# Altium project Linobyte - word.PrjPCB
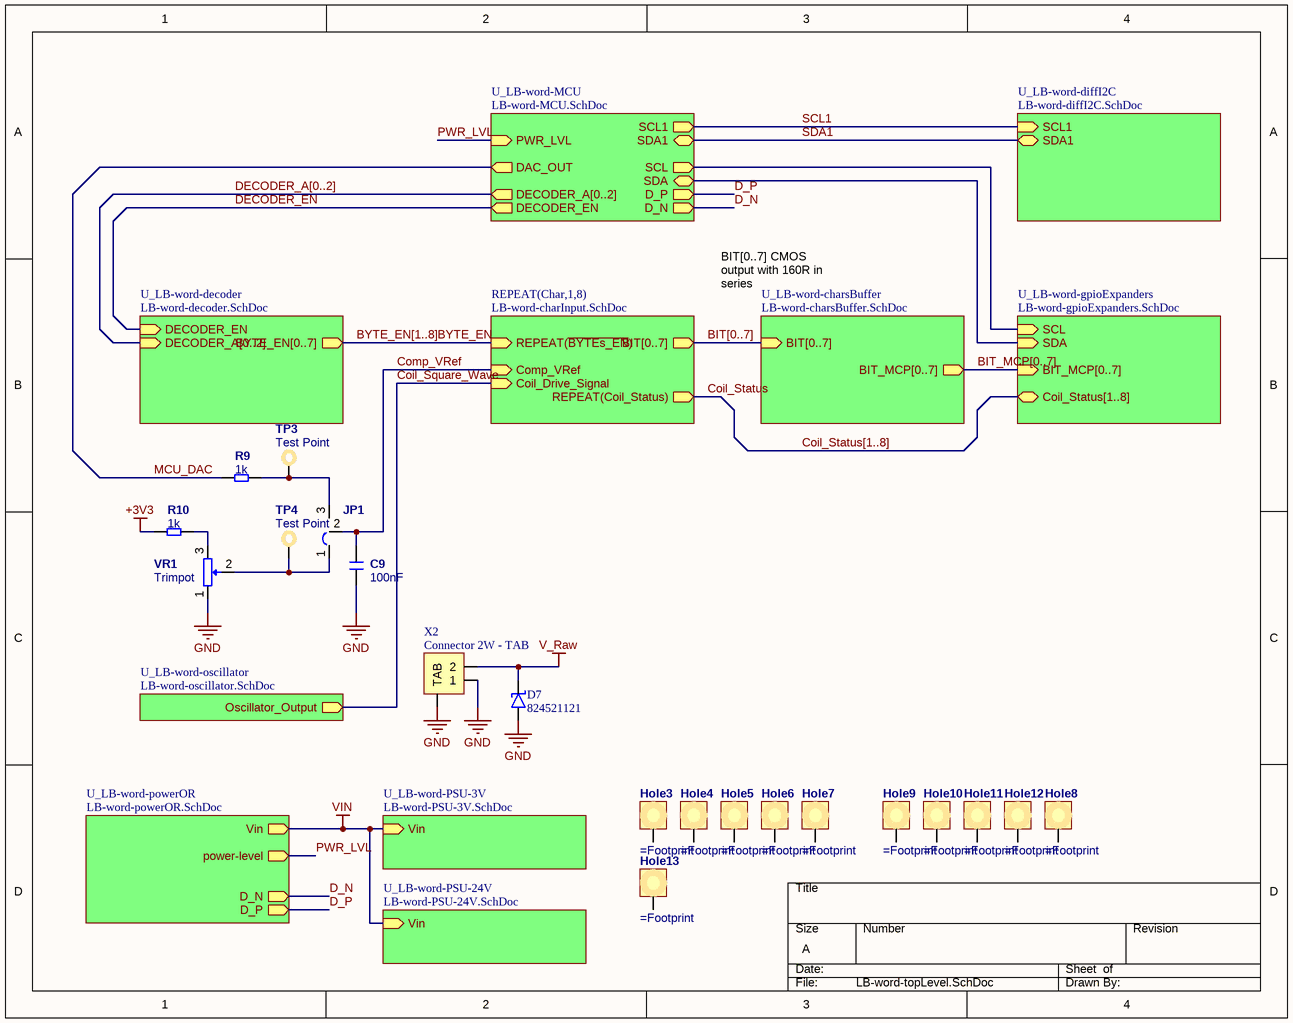
[diagram p0: LB-word-topLevel.SchDoc]
11 sheets, 411 parts. Net scope: hierarchical (ports join the sheet entries above them; power ports are global).
Board file: LB-word-PCB.PcbDoc
Sheets:
  LB-word-topLevel.SchDoc
    Char1 = LB-word-charInput.SchDoc
    Char2 = LB-word-charInput.SchDoc
    Char3 = LB-word-charInput.SchDoc
    Char4 = LB-word-charInput.SchDoc
    Char5 = LB-word-charInput.SchDoc
    Char6 = LB-word-charInput.SchDoc
    Char7 = LB-word-charInput.SchDoc
    Char8 = LB-word-charInput.SchDoc
    U_LB-word-decoder = LB-word-decoder.SchDoc
    U_LB-word-charsBuffer = LB-word-charsBuffer.SchDoc
    U_LB-word-PSU-3V = LB-word-PSU-3V.SchDoc
    U_LB-word-powerOR = LB-word-powerOR.SchDoc
    U_LB-word-PSU-24V = LB-word-PSU-24V.SchDoc
    U_LB-word-gpioExpanders = LB-word-gpioExpanders.SchDoc
    U_LB-word-oscillator = LB-word-oscillator.SchDoc
    U_LB-word-MCU = LB-word-MCU.SchDoc
    U_LB-word-diffI2C = LB-word-diffI2C.SchDoc

## Sheet LB-word-topLevel.SchDoc
size A

### Parts
C9  100nF  [C0603_N]
D7  824521121  [DO214AC SMA]
Hole3  (no value)  [M3 Plated Hole]
Hole4  (no value)  [M3 Plated Hole]
Hole5  (no value)  [M3 Plated Hole]
Hole6  (no value)  [M3 Plated Hole]
Hole7  (no value)  [M3 Plated Hole]
Hole8  (no value)  [M3 Plated Hole]
Hole9  (no value)  [M3 Plated Hole]
Hole10  (no value)  [M3 Plated Hole]
Hole11  (no value)  [M3 Plated Hole]
Hole12  (no value)  [M3 Plated Hole]
Hole13  (no value)  [M3 Plated Hole]
JP1  Jumper 3W  [Jumper SMD 3W NO]  (value not drawn)
R9  1k  [R0603]
R10  1k  [R0603]
TP3  Test Point  [TestPoint-1.2mm]
TP4  Test Point  [TestPoint-1.2mm]
VR1  Trimpot  [Trimpot 3314]
X2  Connector 2W - TAB  [PTSM-2W-H-SMD]

### Sub-sheets
REPEAT(Char,1,8) = LB-word-charInput.SchDoc: BIT[0..7] (out), Comp_VRef (in), REPEAT(~{BYTEs_EN}) (in), REPEAT(Coil_Status) (out), Coil_Drive_Signal (in)
U_LB-word-charsBuffer = LB-word-charsBuffer.SchDoc: BIT[0..7] (in), BIT_MCP[0..7] (out)
U_LB-word-decoder = LB-word-decoder.SchDoc: BYTE_EN[0..7] (out), DECODER_A[0..2] (in), DECODER_EN (in)
U_LB-word-diffI2C = LB-word-diffI2C.SchDoc: SDA1 (bidir), SCL1 (in)
U_LB-word-gpioExpanders = LB-word-gpioExpanders.SchDoc: SCL (in), SDA (in), BIT_MCP[0..7] (in), Coil_Status[1..8] (bidir)
U_LB-word-MCU = LB-word-MCU.SchDoc: SDA (bidir), SCL (out), DAC_OUT (out), DECODER_A[0..2] (out), DECODER_EN (out), D_P (out), D_N (out), SCL1 (out), SDA1 (bidir), PWR_LVL (in)
U_LB-word-oscillator = LB-word-oscillator.SchDoc: Oscillator_Output (out)
U_LB-word-powerOR = LB-word-powerOR.SchDoc: Vin (out), power-level (out), D_N (out), D_P (out)
U_LB-word-PSU-3V = LB-word-PSU-3V.SchDoc: Vin (in)
U_LB-word-PSU-24V = LB-word-PSU-24V.SchDoc: Vin (in)

### Nets
+3V3: R10.1
GND: C9.2 D7.A VR1.1 X2.1 X2.TAB
V_Raw: D7.K X2.2
VIN: sheet U_LB-word-PSU-3V/Vin, sheet U_LB-word-powerOR/Vin, sheet U_LB-word-PSU-24V/Vin
BYTE_EN: sheet REPEAT(Char,1,8)/REPEAT(~{BYTEs_EN})
Coil_Square_Wave: sheet REPEAT(Char,1,8)/Coil_Drive_Signal, sheet U_LB-word-oscillator/Oscillator_Output
Coil_Status: sheet REPEAT(Char,1,8)/REPEAT(Coil_Status)
Comp_VRef: C9.1 JP1.2 ; sheet REPEAT(Char,1,8)/Comp_VRef
D_N: sheet U_LB-word-powerOR/D_N, sheet U_LB-word-MCU/D_N
D_P: sheet U_LB-word-powerOR/D_P, sheet U_LB-word-MCU/D_P
DECODER_EN: sheet U_LB-word-decoder/DECODER_EN, sheet U_LB-word-MCU/DECODER_EN
MCU_DAC: R9.1 ; sheet U_LB-word-MCU/DAC_OUT
PWR_LVL: sheet U_LB-word-powerOR/power-level, sheet U_LB-word-MCU/PWR_LVL  [project net A5]
SCL: sheet U_LB-word-gpioExpanders/SCL, sheet U_LB-word-MCU/SCL
SCL1: sheet U_LB-word-MCU/SCL1, sheet U_LB-word-diffI2C/SCL1
SDA: sheet U_LB-word-gpioExpanders/SDA, sheet U_LB-word-MCU/SDA
SDA1: sheet U_LB-word-MCU/SDA1, sheet U_LB-word-diffI2C/SDA1
NetJP1_1: JP1.1 TP4.1 VR1.2
NetJP1_3: JP1.3 R9.2 TP3.1
NetR10_2: R10.2 VR1.3

Not connected (* = marked no-connect by the designer): Hole3 1; Hole4 1; Hole5 1; Hole6 1; Hole7 1; Hole8 1; Hole9 1; Hole10 1; Hole11 1; Hole12 1; Hole13 1

### Buses and harness runs
bus BIT[0..7] = sheet REPEAT(Char,1,8)/BIT[0..7] = sheet U_LB-word-charsBuffer/BIT[0..7]
bus BIT_MCP[0..7] = sheet U_LB-word-charsBuffer/BIT_MCP[0..7] = sheet U_LB-word-gpioExpanders/BIT_MCP[0..7]
bus BYTE_EN[1..8] = sheet U_LB-word-decoder/BYTE_EN[0..7]
bus Coil_Status[1..8] = sheet U_LB-word-gpioExpanders/Coil_Status[1..8]
bus DECODER_A[0..2] = sheet U_LB-word-decoder/DECODER_A[0..2] = sheet U_LB-word-MCU/DECODER_A[0..2]

### Notes on the sheet
- BIT[0..7] CMOS output with 160R in series

### Library data of the parts
C9 = Capacitor: Capacitor MLCC; Manufacturer: Yageo; Manufacturer Part Number: CC0603KRX7R9BB104; Tolerance (%): 10; Category: Capacitor; Package: 0603; Value: 100nF; Supplier Part Number 1: 1362556; Supplier 1: Farnell; ComponentLink1URL: http://www.yageo.com; ComponentLink1Description: Manufacturer Website; Voltage Rating (Volts): *; Supplier 2: Digi-Key; Supplier Part Number 2: 311-1344-1-ND
D7 = TVS
Hole3-Hole13 = Hole: Footprint: =Footprint
R9 R10 = Resistor: Published: 17-Dec-2003; LatestRevisionDate: 19-Mar-2004; LatestRevisionNote: Silkscreen size reduced.; PackageDocument: Mar-2003; PackageReference: 3-0603; Publisher: Altium Limited; Code_IPC: 1608 [0603]; ComponentLink1Description: Manufacturer Link; ComponentLink1URL: http://www.panasonic.com/industrial/components/resistive_products.htm; ComponentLink2Description: Datasheet; ComponentLink2URL: http://www.panasonic.com/industrial/components/pdf/AOA0000CE2.pdf; Value: 1k

## Sheet LB-word-charInput.SchDoc
size A4
Used 8 times, as channels Char1, Char2, Char3, Char4, Char5, Char6, Char7, Char8. Parts and nets are listed once, with the designators drawn on the sheet.
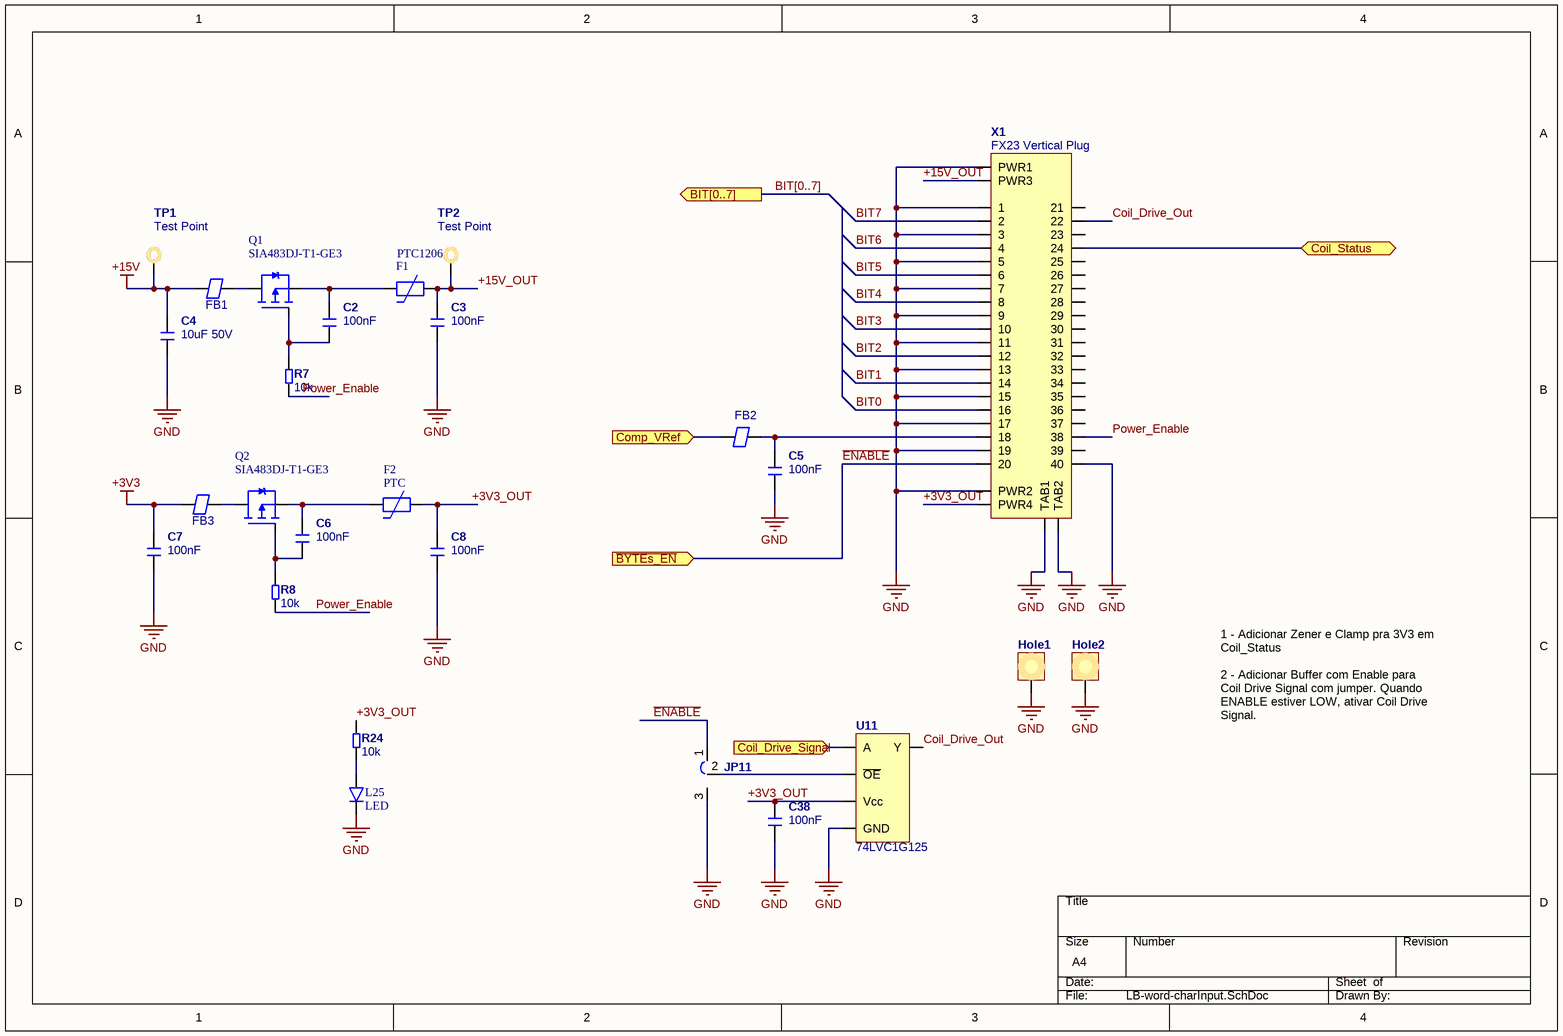
[diagram p1: LB-word-charInput.SchDoc]

### Parts
C2  100nF  [C0603_N]
C3  100nF  [C0603_N]
C4  10uF 50V  [C1210_N]
C5  100nF  [C0603_N]
C6  100nF  [C0603_N]
C7  100nF  [C0603_N]
C8  100nF  [C0603_N]
C38  100nF  [C0603_N]
F1  PTC1206  [C1206_N]
F2  PTC  [PTC0603]
FB1  FB  [F0603_N]  (value not drawn)
FB2  FB  [F0603_N]  (value not drawn)
FB3  FB  [F0603_N]  (value not drawn)
Hole1  (no value)  [M3 Plated Hole]
Hole2  (no value)  [M3 Plated Hole]
JP11  Jumper 3W  [Jumper SMD 3W NO]  (value not drawn)
L25  LED  [LED 0603/1608]
Q1  SIA483DJ-T1-GE3  [SC70-6L]
Q2  SIA483DJ-T1-GE3  [SC70-6L]
R7  10k  [R0603]
R8  10k  [R0603]
R24  10k  [R0603]
TP1  Test Point  [TestPoint-1.2mm]
TP2  Test Point  [TestPoint-1.2mm]
U11  74LVC1G125  [SC70-5]
X1  FX23 Vertical Plug  [FX23-40P]

### Ports
BIT[0..7] (out), Coil_Drive_Signal (in), Coil_Status (bidir), Comp_VRef (in), ~{BYTEs_EN} (in)

### Nets
+3V3: C7.1 FB3.1
+15V: C4.1 FB1.1 TP1.1
GND: C3.2 C4.2 C5.2 C7.2 C8.2 C38.2 Hole1.1 Hole2.1 JP11.3 L25.1(K) U11.3(GND) X1.1 X1.3 X1.5 X1.7 X1.9 X1.11 X1.13 X1.15 X1.17 X1.19 X1.40 X1.PWR1 X1.PWR2 X1.TAB1 X1.TAB2
+3V3_OUT: C8.1 C38.1 F2.2 R24.2 U11.5(Vcc) X1.PWR4
+15V_OUT: C3.1 F1.2 TP2.1 X1.PWR3
~{ENABLE}: JP11.1 X1.20 ; port ~{BYTEs_EN}
BIT0: X1.16
BIT1: X1.14
BIT2: X1.12
BIT3: X1.10
BIT4: X1.8
BIT5: X1.6
BIT6: X1.4
BIT7: X1.2
Coil_Drive_Out: U11.4(Y) X1.22
Coil_Drive_Signal: U11.2(A) ; port Coil_Drive_Signal
Coil_Status: X1.24 ; port Coil_Status
Comp_VRef: FB2.1 ; port Comp_VRef
Power_Enable: R7.1 R8.1 X1.38
NetC2_1: C2.1 F1.1 Q1.S
NetC2_2: C2.2 Q1.G R7.2
NetC5_1: C5.1 FB2.2 X1.18
NetC6_1: C6.1 F2.1 Q2.S
NetC6_2: C6.2 Q2.G R8.2
NetFB1_2: FB1.2 Q1.D
NetFB3_2: FB3.2 Q2.D
NetJP11_2: JP11.2 U11.1(~{OE})
NetL25_2: L25.2(A) R24.1

Not connected (* = marked no-connect by the designer): X1 21 23 25 26 27 28 29 30 31 32 33 34 35 36 37 39

### Channels
Char1: designators end in _Char1; ports Coil_Drive_Signal=Coil_Square_Wave Coil_Status=Coil_Status1 Comp_VRef=Comp_VRef ~{BYTEs_EN}=~{ENABLE}
Char2: designators end in _Char2; ports Coil_Drive_Signal=Coil_Square_Wave Coil_Status=Coil_Status2 Comp_VRef=Comp_VRef ~{BYTEs_EN}=~{ENABLE}
Char3: designators end in _Char3; ports Coil_Drive_Signal=Coil_Square_Wave Coil_Status=Coil_Status3 Comp_VRef=Comp_VRef ~{BYTEs_EN}=~{ENABLE}
Char4: designators end in _Char4; ports Coil_Drive_Signal=Coil_Square_Wave Coil_Status=Coil_Status4 Comp_VRef=Comp_VRef ~{BYTEs_EN}=~{ENABLE}
Char5: designators end in _Char5; ports Coil_Drive_Signal=Coil_Square_Wave Coil_Status=Coil_Status5 Comp_VRef=Comp_VRef ~{BYTEs_EN}=~{ENABLE}
Char6: designators end in _Char6; ports Coil_Drive_Signal=Coil_Square_Wave Coil_Status=Coil_Status6 Comp_VRef=Comp_VRef ~{BYTEs_EN}=~{ENABLE}
Char7: designators end in _Char7; ports Coil_Drive_Signal=Coil_Square_Wave Coil_Status=Coil_Status7 Comp_VRef=Comp_VRef ~{BYTEs_EN}=~{ENABLE}
Char8: designators end in _Char8; ports Coil_Drive_Signal=Coil_Square_Wave Coil_Status=Coil_Status8 Comp_VRef=Comp_VRef ~{BYTEs_EN}=~{ENABLE}

### Buses and harness runs
bus BIT[0..7] = port BIT[0..7]

### Notes on the sheet
- 1 - Adicionar Zener e Clamp pra 3V3 em Coil_Status
  2 - Adicionar Buffer com Enable para Coil Drive Signal com jumper. Quando ENABLE estiver LOW, ativar Coil Drive Signal.

### Library data of the parts
C2-C8 C38 = Capacitor: as C9 on sheet LB-word-topLevel; Category: Capacitor; Package: 0603; Supplier Part Number 1: 1362556; Supplier 1: Farnell; ComponentLink1URL: http://www.yageo.com; ComponentLink1Description: Manufacturer Website; Voltage Rating (Volts): *; Supplier 2: Digi-Key; Supplier Part Number 2: 311-1344-1-ND
  C2 C3 C5-C8 C38: Value: 100nF
  C4: Value: 10uF 50V
F1 F2 = PTC: PTC, Resettable Fuse
FB1-FB3 = Ferrite Bead
Hole1 Hole2 = Hole: Footprint: =Footprint
Q1 Q2 = MOSFET P CH
R7 R8 R24 = Resistor: Published: 17-Dec-2003; LatestRevisionDate: 19-Mar-2004; LatestRevisionNote: Silkscreen size reduced.; PackageDocument: Mar-2003; PackageReference: 3-0603; Publisher: Altium Limited; Code_IPC: 1608 [0603]; ComponentLink1Description: Manufacturer Link; ComponentLink1URL: http://www.panasonic.com/industrial/components/resistive_products.htm; ComponentLink2Description: Datasheet; ComponentLink2URL: http://www.panasonic.com/industrial/components/pdf/AOA0000CE2.pdf; Value: 10k
U11 = 74LVC1G125: Buffer with Enable
X1 = FX23-40P

## Sheet LB-word-decoder.SchDoc
size A4
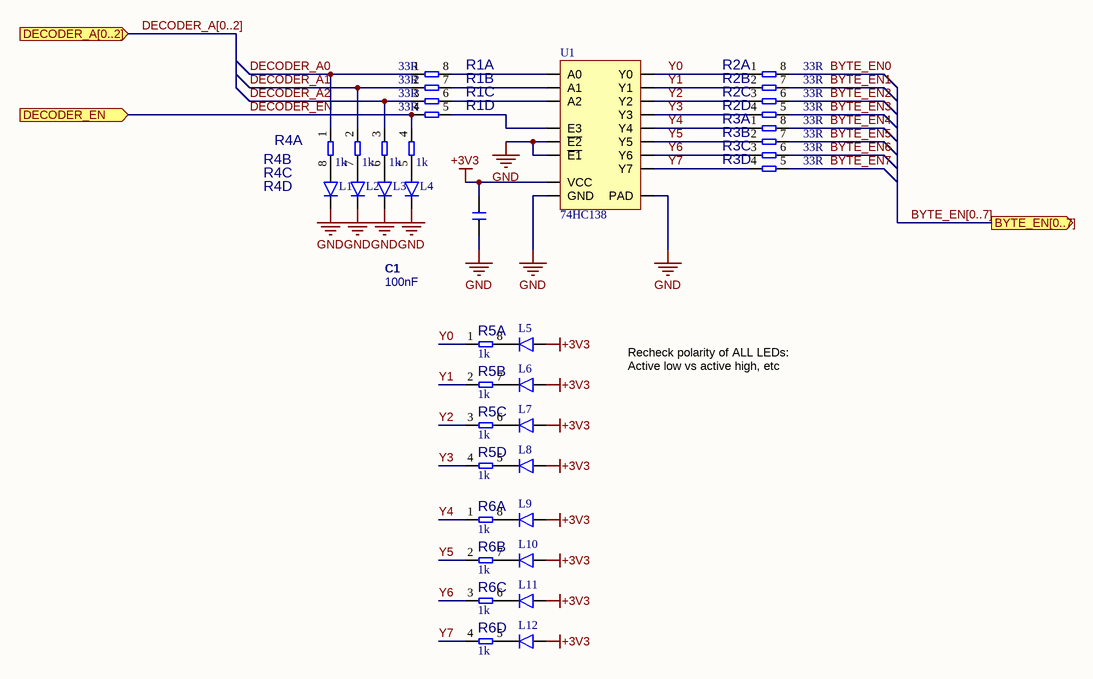
[diagram p2: LB-word-decoder.SchDoc]

### Parts
C1  100nF  [C0603_N]
L1  LED  [LED 0603/1608]  (value not drawn)
L2  LED  [LED 0603/1608]  (value not drawn)
L3  LED  [LED 0603/1608]  (value not drawn)
L4  LED  [LED 0603/1608]  (value not drawn)
L5  LED  [LED 0603/1608]  (value not drawn)
L6  LED  [LED 0603/1608]  (value not drawn)
L7  LED  [LED 0603/1608]  (value not drawn)
L8  LED  [LED 0603/1608]  (value not drawn)
L9  LED  [LED 0603/1608]  (value not drawn)
L10  LED  [LED 0603/1608]  (value not drawn)
L11  LED  [LED 0603/1608]  (value not drawn)
L12  LED  [LED 0603/1608]  (value not drawn)
R1  value 33R  [YC164]  (parts A,B,C,D of 4)
R2  value 33R  [YC164]  (parts A,B,C,D of 4)
R3  value 33R  [YC164]  (parts A,B,C,D of 4)
R4  value 1k  [YC164]  (parts A,B,C,D of 4)
R5  value 1k  [YC164]  (parts A,B,C,D of 4)
R6  value 1k  [YC164]  (parts A,B,C,D of 4)
U1  74HC138  [DHVQFN16]

### Ports
BYTE_EN[0..7] (out), DECODER_A[0..2] (in), DECODER_EN (in)

### Nets
+3V3: C1.1 L5.2(A) L6.2(A) L7.2(A) L8.2(A) L9.2(A) L10.2(A) L11.2(A) L12.2(A) U1.16(VCC)
GND: C1.2 L1.1(K) L2.1(K) L3.1(K) L4.1(K) U1.4(~{E1}) U1.5(~{E2}) U1.8(GND) U1.PAD
BYTE_EN0: R2.8  [project net ~{ENABLE}]
BYTE_EN1: R2.7  [project net ~{ENABLE}]
BYTE_EN2: R2.6  [project net ~{ENABLE}]
BYTE_EN3: R2.5  [project net ~{ENABLE}]
BYTE_EN4: R3.8  [project net ~{ENABLE}]
BYTE_EN5: R3.7  [project net ~{ENABLE}]
BYTE_EN6: R3.6  [project net ~{ENABLE}]
BYTE_EN7: R3.5  [project net ~{ENABLE}]
DECODER_A0: R1.1 R4.1
DECODER_A1: R1.2 R4.2
DECODER_A2: R1.3 R4.3
DECODER_EN: R1.4 R4.4 ; port DECODER_EN
Y0: R2.1 R5.1 U1.15(Y0)
Y1: R2.2 R5.2 U1.14(Y1)
Y2: R2.3 R5.3 U1.13(Y2)
Y3: R2.4 R5.4 U1.12(Y3)
Y4: R3.1 R6.1 U1.11(Y4)
Y5: R3.2 R6.2 U1.10(Y5)
Y6: R3.3 R6.3 U1.9(Y6)
Y7: R3.4 R6.4 U1.7(Y7)
NetL1_2: L1.2(A) R4.8
NetL2_2: L2.2(A) R4.7
NetL3_2: L3.2(A) R4.6
NetL4_2: L4.2(A) R4.5
NetL5_1: L5.1(K) R5.8
NetL6_1: L6.1(K) R5.7
NetL7_1: L7.1(K) R5.6
NetL8_1: L8.1(K) R5.5
NetL9_1: L9.1(K) R6.8
NetL10_1: L10.1(K) R6.7
NetL11_1: L11.1(K) R6.6
NetL12_1: L12.1(K) R6.5
NetR1_5: R1.5 U1.6(E3)
NetR1_6: R1.6 U1.3(A2)
NetR1_7: R1.7 U1.2(A1)
NetR1_8: R1.8 U1.1(A0)

### Buses and harness runs
bus BYTE_EN[0..7] = port BYTE_EN[0..7]
bus DECODER_A[0..2] = port DECODER_A[0..2]

### Notes on the sheet
- Recheck polarity of ALL LEDs:
  Active low vs active high, etc

### Library data of the parts
C1 = Capacitor: as C9 on sheet LB-word-topLevel; Category: Capacitor; Package: 0603; Value: 100nF; Supplier Part Number 1: 1362556; Supplier 1: Farnell; ComponentLink1URL: http://www.yageo.com; ComponentLink1Description: Manufacturer Website; Voltage Rating (Volts): *; Supplier 2: Digi-Key; Supplier Part Number 2: 311-1344-1-ND
R1-R6 = Resistor Array - 4P
U1 = 74HC138: 3 to 8 Decoder

## Sheet LB-word-charsBuffer.SchDoc
size A4
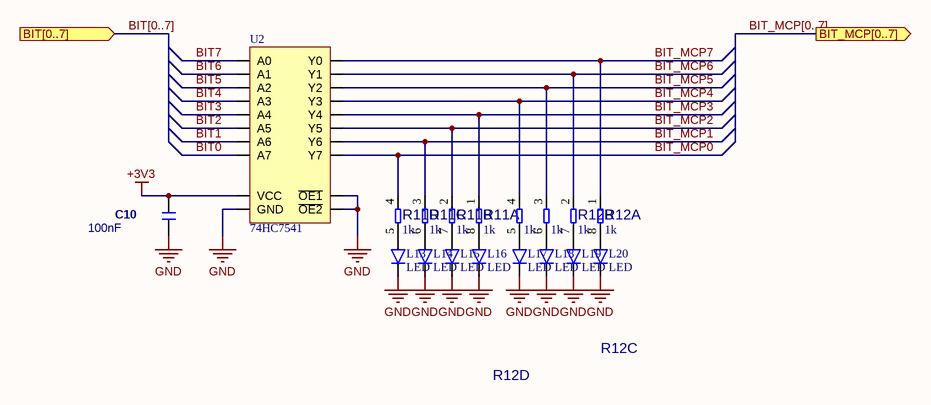
[diagram p3: LB-word-charsBuffer.SchDoc]

### Parts
C10  100nF  [C0603_N]
L13  LED  [LED 0603/1608]
L14  LED  [LED 0603/1608]
L15  LED  [LED 0603/1608]
L16  LED  [LED 0603/1608]
L17  LED  [LED 0603/1608]
L18  LED  [LED 0603/1608]
L19  LED  [LED 0603/1608]
L20  LED  [LED 0603/1608]
R11  value 1k  [YC164]  (parts A,B,C,D of 4)
R12  value 1k  [YC164]  (parts A,B,C,D of 4)
U2  74HC7541  [TSSOP20_N]

### Ports
BIT[0..7] (in), BIT_MCP[0..7] (out)

### Nets
+3V3: C10.1 U2.20(VCC)
GND: C10.2 L13.1(K) L14.1(K) L15.1(K) L16.1(K) L17.1(K) L18.1(K) L19.1(K) L20.1(K) U2.1(~{OE1}) U2.10(GND) U2.19(~{OE2})
BIT0: U2.9(A7)
BIT1: U2.8(A6)
BIT2: U2.7(A5)
BIT3: U2.6(A4)
BIT4: U2.5(A3)
BIT5: U2.4(A2)
BIT6: U2.3(A1)
BIT7: U2.2(A0)
BIT_MCP0: R11.4 U2.11(Y7)
BIT_MCP1: R11.3 U2.12(Y6)
BIT_MCP2: R11.2 U2.13(Y5)
BIT_MCP3: R11.1 U2.14(Y4)
BIT_MCP4: R12.4 U2.15(Y3)
BIT_MCP5: R12.3 U2.16(Y2)
BIT_MCP6: R12.2 U2.17(Y1)
BIT_MCP7: R12.1 U2.18(Y0)
NetL13_2: L13.2(A) R11.5
NetL14_2: L14.2(A) R11.6
NetL15_2: L15.2(A) R11.7
NetL16_2: L16.2(A) R11.8
NetL17_2: L17.2(A) R12.5
NetL18_2: L18.2(A) R12.6
NetL19_2: L19.2(A) R12.7
NetL20_2: L20.2(A) R12.8

### Buses and harness runs
bus BIT[0..7] = port BIT[0..7]
bus BIT_MCP[0..7] = port BIT_MCP[0..7]

### Library data of the parts
C10 = Capacitor: as C9 on sheet LB-word-topLevel; Category: Capacitor; Package: 0603; Value: 100nF; Supplier Part Number 1: 1362556; Supplier 1: Farnell; ComponentLink1URL: http://www.yageo.com; ComponentLink1Description: Manufacturer Website; Voltage Rating (Volts): *; Supplier 2: Digi-Key; Supplier Part Number 2: 311-1344-1-ND
R11 R12 = Resistor Array - 4P
U2 = 74HC7541: Schmitt Trigger Octal

## Sheet LB-word-PSU-3V.SchDoc
size A
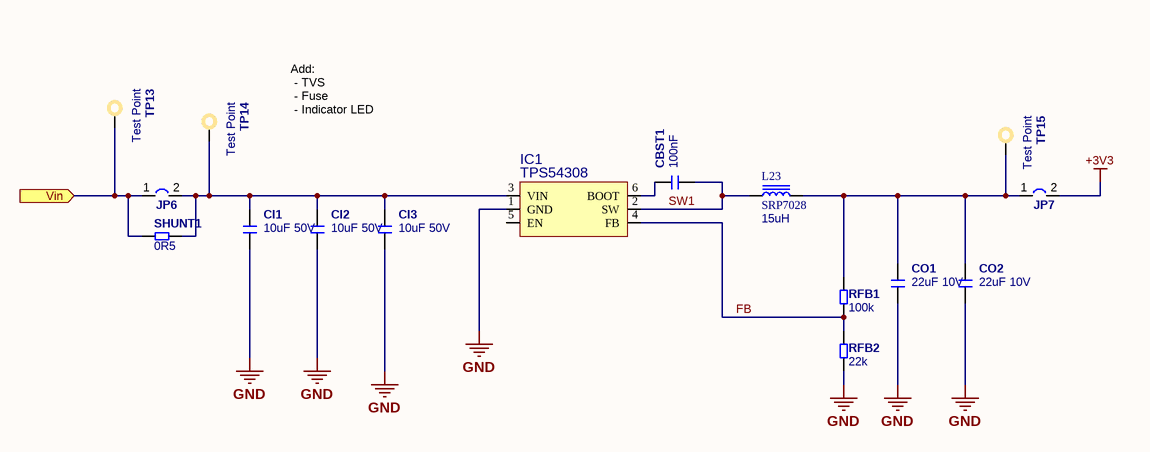
[diagram p4: LB-word-PSU-3V.SchDoc]

### Parts
CBST1  100nF  [C0603_N]
CI1  10uF 50V  [C1210_N]
CI2  10uF 50V  [C1210_N]
CI3  10uF 50V  [C1210_N]
CO1  22uF 10V  [C1210_N]
CO2  22uF 10V  [C1210_N]
IC1  TPS54308  [SOT23]
JP6  Jumper 2W  [Jumper SMD 2W NO]  (value not drawn)
JP7  Jumper 2W  [Jumper SMD 2W NO]  (value not drawn)
L23  SRP7028  value 15uH  [Inductor SRP7028]
RFB1  100k  [R0603]
RFB2  22k  [R0603]
SHUNT1  0R5  [R0603]
TP13  Test Point  [TestPoint-1.2mm]
TP14  Test Point  [TestPoint-1.2mm]
TP15  Test Point  [TestPoint-1.2mm]

### Ports
Vin (in)

### Nets
+3V3: JP7.2
GND: CI1.2 CI2.2 CI3.2 CO1.2 CO2.2 IC1.1(GND) RFB2.1
VIN: JP6.1 SHUNT1.1 TP13.1 ; port Vin
FB: IC1.4(FB) RFB1.1 RFB2.2
SW1: CBST1.2 IC1.2(SW) L23.1
NetCBST1_1: CBST1.1 IC1.6(BOOT)
NetCI1_1: CI1.1 CI2.1 CI3.1 IC1.3(VIN) JP6.2 SHUNT1.2 TP14.1
NetCO1_1: CO1.1 CO2.1 JP7.1 L23.2 RFB1.2 TP15.1

Not connected (* = marked no-connect by the designer): IC1 5(EN)

### Notes on the sheet
- Add:
  - TVS
  - Fuse
  - Indicator LED

### Library data of the parts
CBST1 CI1-CI3 CO1 CO2 = Capacitor: as C9 on sheet LB-word-topLevel; Category: Capacitor; Package: 0603; Supplier Part Number 1: 1362556; Supplier 1: Farnell; ComponentLink1URL: http://www.yageo.com; ComponentLink1Description: Manufacturer Website; Voltage Rating (Volts): *; Supplier 2: Digi-Key; Supplier Part Number 2: 311-1344-1-ND
  CBST1: Value: 100nF
  CI1-CI3: Value: 10uF 50V
  CO1 CO2: Value: 22uF 10V
IC1 = TPS54308: Buck Converter
L23 = Inductor
RFB1 RFB2 SHUNT1 = Resistor: Published: 17-Dec-2003; LatestRevisionDate: 19-Mar-2004; LatestRevisionNote: Silkscreen size reduced.; PackageDocument: Mar-2003; PackageReference: 3-0603; Publisher: Altium Limited; Code_IPC: 1608 [0603]; ComponentLink1Description: Manufacturer Link; ComponentLink1URL: http://www.panasonic.com/industrial/components/resistive_products.htm; ComponentLink2Description: Datasheet; ComponentLink2URL: http://www.panasonic.com/industrial/components/pdf/AOA0000CE2.pdf
  RFB1: Value: 100k
  RFB2: Value: 22k
  SHUNT1: Value: 0R5

## Sheet LB-word-powerOR.SchDoc
size A4
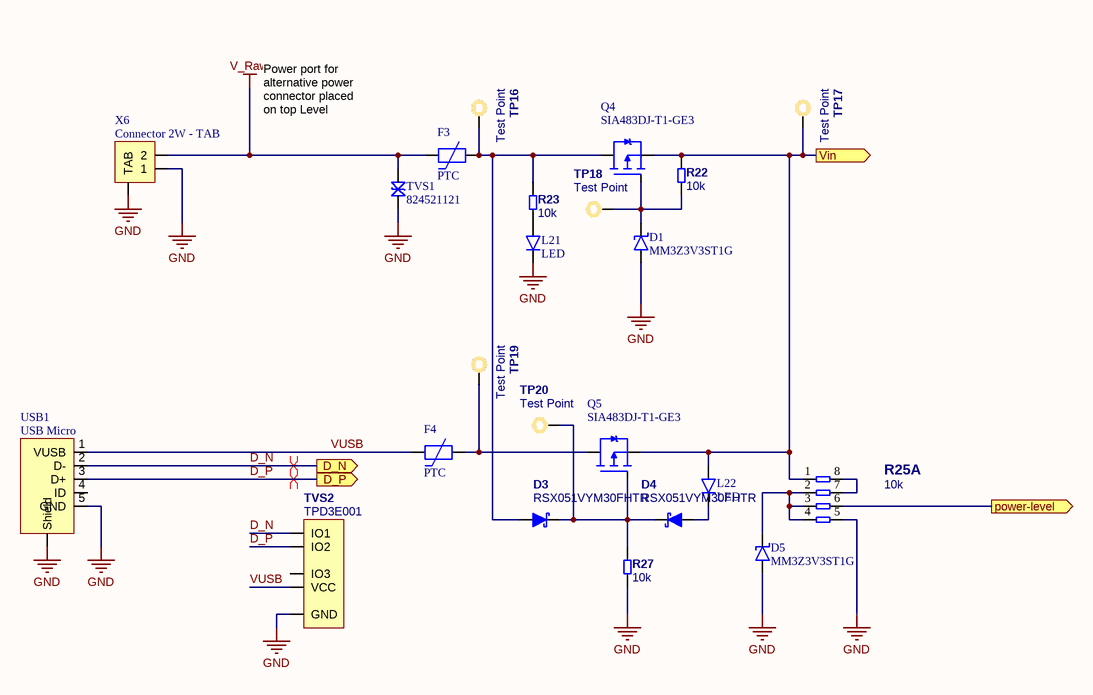
[diagram p5: LB-word-powerOR.SchDoc]

### Parts
D1  MM3Z3V3ST1G  [SOD323F-Comchip Variant]
D3  RSX051VYM30FHTR  [SOD323F]
D4  RSX051VYM30FHTR  [SOD323F]
D5  MM3Z3V3ST1G  [SOD323F-Comchip Variant]
F3  PTC  [1812]
F4  PTC  [1812]
L21  LED  [LED 0603/1608]
L22  LED  [LED 0603/1608]
Q4  SIA483DJ-T1-GE3  [SC70-6L]
Q5  SIA483DJ-T1-GE3  [SC70-6L]
R22  10k  [R0603]
R23  10k  [R0603]
R25  value 10k  [YC164]  (parts A,B,C,D of 4)
R27  10k  [R0603]
TP16  Test Point  [TestPoint-1.2mm]
TP17  Test Point  [TestPoint-1.2mm]
TP18  Test Point  [TestPoint-1.2mm]
TP19  Test Point  [TestPoint-1.2mm]
TP20  Test Point  [TestPoint-1.2mm]
TVS1  824521121  [DO214AC SMA]
TVS2  TPD3E001  [SOT23-5_N]
USB1  USB Micro  [USB Micro]
X6  Connector 2W - TAB  [PTSM-2W-H-SMD]

### Ports
D_N (out), D_P (out), power-level (out), Vin (out)

### Nets
GND: D1.1 D5.A L21.1(K) R25.5 R27.1 TVS1.2 TVS2.3(GND) USB1.5(GND) USB1.Shield X6.1 X6.TAB
V_Raw: F3.1 TVS1.1 X6.2
VIN: L22.2(A) Q4.S Q5.S R22.2 R25.1 TP17.1 ; port Vin
A5: R25.6 ; port power-level
D_N: TVS2.1(IO1) USB1.2(D-) ; port D_N
D_P: TVS2.2(IO2) USB1.3(D+) ; port D_P
VUSB: F4.1 TVS2.5(VCC) USB1.1(VUSB)
NetD1_2: D1.2 Q4.G R22.1 TP18.1
NetD3_A: D3.A F3.2 Q4.D R23.2 TP16.1
NetD3_K: D3.K D4.K Q5.G R27.2 TP20.1
NetD4_A: D4.A L22.1(K)
NetD5_K: D5.K R25.2 R25.3 R25.4
NetF4_2: F4.2 Q5.D TP19.1
NetL21_2: L21.2(A) R23.1
NetR25_7: R25.7 R25.8

Not connected (* = marked no-connect by the designer): TVS2 4(IO3); USB1 4(ID)

### Layout directives
differential pair: D_N, D_P

### Notes on the sheet
- Power port for alternative power connector placed on top Level sheet

### Library data of the parts
D1 D5 = TVS
D3 D4 = Diode Schottky
F3 F4 = PTC: PTC, Resettable Fuse
Q4 Q5 = MOSFET P CH
R22 R23 R27 = Resistor: Published: 17-Dec-2003; LatestRevisionDate: 19-Mar-2004; LatestRevisionNote: Silkscreen size reduced.; PackageDocument: Mar-2003; PackageReference: 3-0603; Publisher: Altium Limited; Code_IPC: 1608 [0603]; ComponentLink1Description: Manufacturer Link; ComponentLink1URL: http://www.panasonic.com/industrial/components/resistive_products.htm; ComponentLink2Description: Datasheet; ComponentLink2URL: http://www.panasonic.com/industrial/components/pdf/AOA0000CE2.pdf; Value: 10k
R25 = Resistor Array - 4P
TVS1 = TVS Bidirectional

## Sheet LB-word-PSU-24V.SchDoc
size A
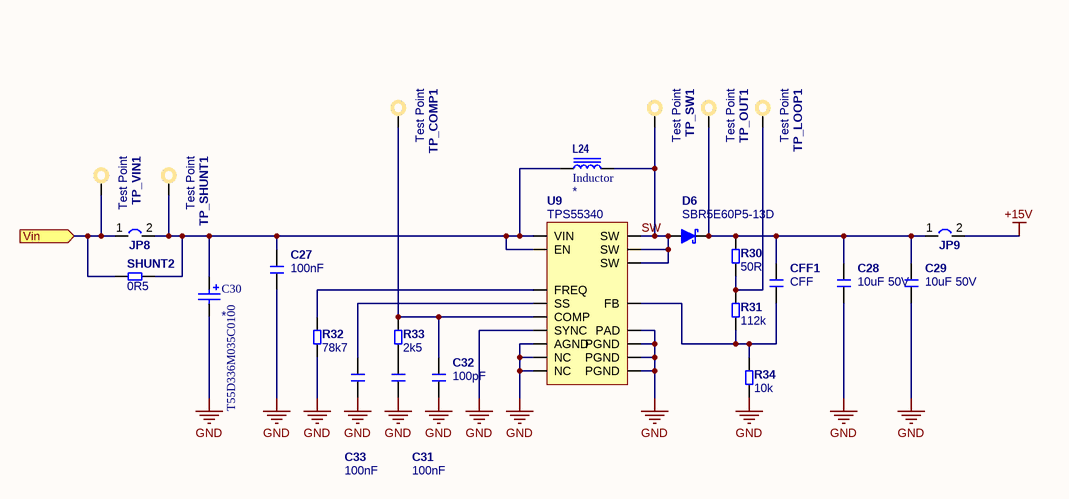
[diagram p6: LB-word-PSU-24V.SchDoc]

### Parts
C27  100nF  [C0603_N]
C28  10uF 50V  [C1210_N]
C29  10uF 50V  [C1210_N]
C30  T55D336M035C0100  [2917 - Case D]
C31  100nF  [C0603_N]
C32  100pF  [C0603_N]
C33  100nF  [C0603_N]
CFF1  CFF  [C0603_N]
D6  SBR5E60P5-13D  [PowerDI5]
JP8  Jumper 2W  [Jumper SMD 2W NO]  (value not drawn)
JP9  Jumper 2W  [Jumper SMD 2W NO]  (value not drawn)
L24  Inductor  [INDUCTOR SRP1040]
R30  50R  [R0603]
R31  112k  [R0603]
R32  78k7  [R0603]
R33  2k5  [R0603]
R34  10k  [R0603]
SHUNT2  0R5  [R0603]
TP_COMP1  Test Point  [TestPoint-1.2mm]
TP_LOOP1  Test Point  [TestPoint-1.2mm]
TP_OUT1  Test Point  [TestPoint-1.2mm]
TP_SHUNT1  Test Point  [TestPoint-1.2mm]
TP_SW1  Test Point  [TestPoint-1.2mm]
TP_VIN1  Test Point  [TestPoint-1.2mm]
U9  TPS55340  [QFN16]

### Ports
Vin (in)

### Nets
+15V: JP9.2
GND: C27.2 C28.2 C29.2 C30.2 C31.2 C32.2 C33.2 R32.1 R34.1 U9.5(SYNC) U9.6(AGND) U9.10(NC) U9.11(PGND) U9.12(PGND) U9.13(PGND) U9.14(NC) U9.PAD
VIN: JP8.1 SHUNT2.1 TP_VIN1.1 ; port Vin
SW: D6.A L24.2 TP_SW1.1 U9.1(SW) U9.15(SW) U9.16(SW)
NetC27_1: C27.1 C30.1 JP8.2 L24.1 SHUNT2.2 TP_SHUNT1.1 U9.2(VIN) U9.3(EN)
NetC28_1: C28.1 C29.1 CFF1.1 D6.K JP9.1 R30.2 TP_OUT1.1
NetC31_1: C31.1 R33.1
NetC32_1: C32.1 R33.2 TP_COMP1.1 U9.7(COMP)
NetC33_1: C33.1 U9.4(SS)
NetCFF1_2: CFF1.2 R31.1 R34.2 U9.8(FB)
NetR30_1: R30.1 R31.2 TP_LOOP1.1
NetR32_2: R32.2 U9.9(FREQ)

### Library data of the parts
C27-C29 C31-C33 CFF1 = Capacitor: as C9 on sheet LB-word-topLevel; Category: Capacitor; Package: 0603; Supplier Part Number 1: 1362556; Supplier 1: Farnell; ComponentLink1URL: http://www.yageo.com; ComponentLink1Description: Manufacturer Website; Voltage Rating (Volts): *; Supplier 2: Digi-Key; Supplier Part Number 2: 311-1344-1-ND
  C27 C31 C33: Value: 100nF
  C28 C29: Value: 10uF 50V
  C32: Value: 100pF
  CFF1: Value: CFF
C30 = Capacitor Polarized: Polarized Cap; Published: 17-Jul-2002; LatestRevisionDate: 19-Mar-2004; LatestRevisionNote: Silkscreen dimensions re-sized.; DatasheetDocument: Mar-2001; PackageDocument: Mar-2001; PackageReference: D; Publisher: Altium Limited; Code_JEITA: 7343-31; ComponentLink1Description: Manufacturer Link; ComponentLink1URL: http://www.kemet.com/; ComponentLink2Description: Datasheet; ComponentLink2URL: http://www.kemet.com/kemet/web/homepage/kechome.nsf/vapubfilesname/F3102TA.pdf/$file/F3102TA.pdf; Value: *
D6 = Diode Schottky
R30-R34 SHUNT2 = Resistor: Published: 17-Dec-2003; LatestRevisionDate: 19-Mar-2004; LatestRevisionNote: Silkscreen size reduced.; PackageDocument: Mar-2003; PackageReference: 3-0603; Publisher: Altium Limited; Code_IPC: 1608 [0603]; ComponentLink1Description: Manufacturer Link; ComponentLink1URL: http://www.panasonic.com/industrial/components/resistive_products.htm; ComponentLink2Description: Datasheet; ComponentLink2URL: http://www.panasonic.com/industrial/components/pdf/AOA0000CE2.pdf
  R30: Value: 50R
  R31: Value: 112k
  R32: Value: 78k7
  R33: Value: 2k5
  R34: Value: 10k
  SHUNT2: Value: 0R5
U9 = TPS55340: Boost/SEPIC/Flyback converter
L24 = Inductor: Value: *

## Sheet LB-word-gpioExpanders.SchDoc
size A
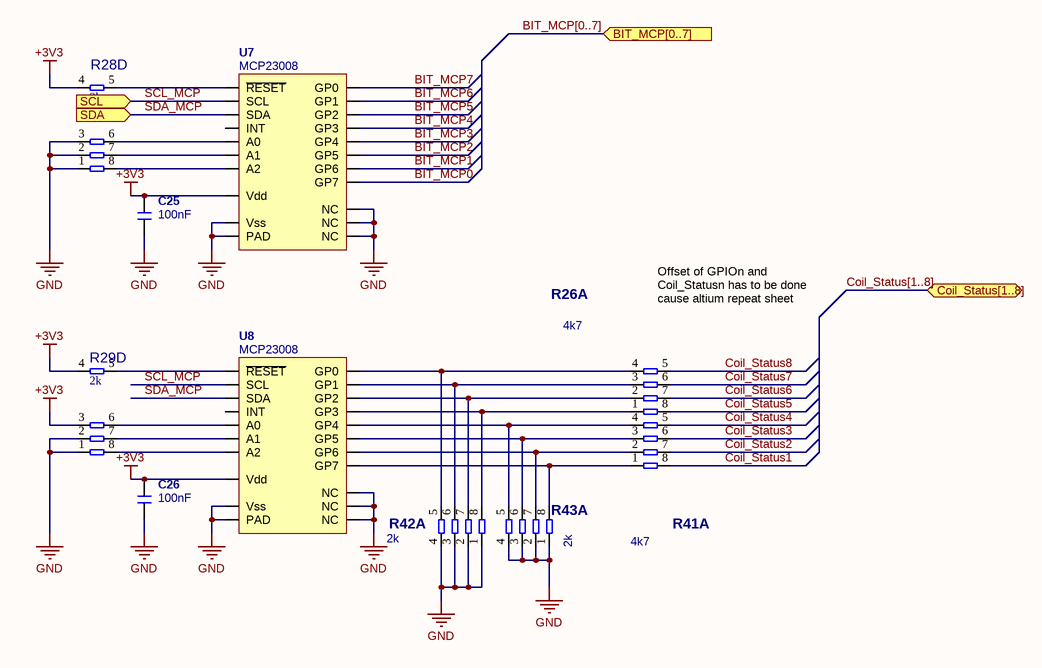
[diagram p7: LB-word-gpioExpanders.SchDoc]

### Parts
C25  100nF  [C0603_N]
C26  100nF  [C0603_N]
R26  value 4k7  [YC164]  (parts A,B,C,D of 4)
R28  (no value)  [YC164]  (parts A,B,C,D of 4)
R29  (no value)  [YC164]  (parts A,B,C,D of 4)
R41  value 4k7  [YC164]  (parts A,B,C,D of 4)
R42  value 2k  [YC164]  (parts A,B,C,D of 4)
R43  value 2k  [YC164]  (parts A,B,C,D of 4)
U7  MCP23008  [QFN20]
U8  MCP23008  [QFN20]

### Ports
BIT_MCP[0..7] (in), Coil_Status[1..8] (bidir), SCL (in), SDA (in)

### Nets
+3V3: C25.1 C26.1 R28.4 R29.3 R29.4 U7.18(Vdd) U8.18(Vdd)
GND: C25.2 C26.2 R28.1 R28.2 R28.3 R29.1 R29.2 R42.1 R42.2 R42.3 R42.4 R43.1 R43.2 R43.3 R43.4 U7.5(NC) U7.6(NC) U7.8(NC) U7.17(Vss) U7.PAD U8.5(NC) U8.6(NC) U8.8(NC) U8.17(Vss) U8.PAD
BIT_MCP0: U7.16(GP7)
BIT_MCP1: U7.15(GP6)
BIT_MCP2: U7.14(GP5)
BIT_MCP3: U7.13(GP4)
BIT_MCP4: U7.12(GP3)
BIT_MCP5: U7.11(GP2)
BIT_MCP6: U7.10(GP1)
BIT_MCP7: U7.9(GP0)
Coil_Status1: R41.8
Coil_Status2: R41.7
Coil_Status3: R41.6
Coil_Status4: R41.5
Coil_Status5: R26.8
Coil_Status6: R26.7
Coil_Status7: R26.6
Coil_Status8: R26.5
SCL_MCP: U7.19(SCL) U8.19(SCL) ; port SCL  [project net SCL]
SDA_MCP: U7.20(SDA) U8.20(SDA) ; port SDA  [project net SDA]
NetR26_1: R26.1 R42.8 U8.12(GP3)
NetR26_2: R26.2 R42.7 U8.11(GP2)
NetR26_3: R26.3 R42.6 U8.10(GP1)
NetR26_4: R26.4 R42.5 U8.9(GP0)
NetR28_5: R28.5 U7.4(~{RESET})
NetR28_6: R28.6 U7.3(A0)
NetR28_7: R28.7 U7.2(A1)
NetR28_8: R28.8 U7.1(A2)
NetR29_5: R29.5 U8.4(~{RESET})
NetR29_6: R29.6 U8.3(A0)
NetR29_7: R29.7 U8.2(A1)
NetR29_8: R29.8 U8.1(A2)
NetR41_1: R41.1 R43.8 U8.16(GP7)
NetR41_2: R41.2 R43.7 U8.15(GP6)
NetR41_3: R41.3 R43.6 U8.14(GP5)
NetR41_4: R41.4 R43.5 U8.13(GP4)

Not connected (* = marked no-connect by the designer): U7 7(INT); U8 7(INT)

### Buses and harness runs
bus BIT_MCP[0..7] = port BIT_MCP[0..7]
bus Coil_Status[1..8] = port Coil_Status[1..8]

### Notes on the sheet
- Offset of GPIOn and Coil_Statusn has to be done cause altium repeat sheet does not support start at zero.

### Library data of the parts
C25 C26 = Capacitor: as C9 on sheet LB-word-topLevel; Category: Capacitor; Package: 0603; Value: 100nF; Supplier Part Number 1: 1362556; Supplier 1: Farnell; ComponentLink1URL: http://www.yageo.com; ComponentLink1Description: Manufacturer Website; Voltage Rating (Volts): *; Supplier 2: Digi-Key; Supplier Part Number 2: 311-1344-1-ND
R26 R41-R43 = Resistor Array - 4P
R28 R29 = Resistor Array - 4P: Value: 2k
U7 U8 = MCP23008: I2C Port Expander

## Sheet LB-word-oscillator.SchDoc
size A4
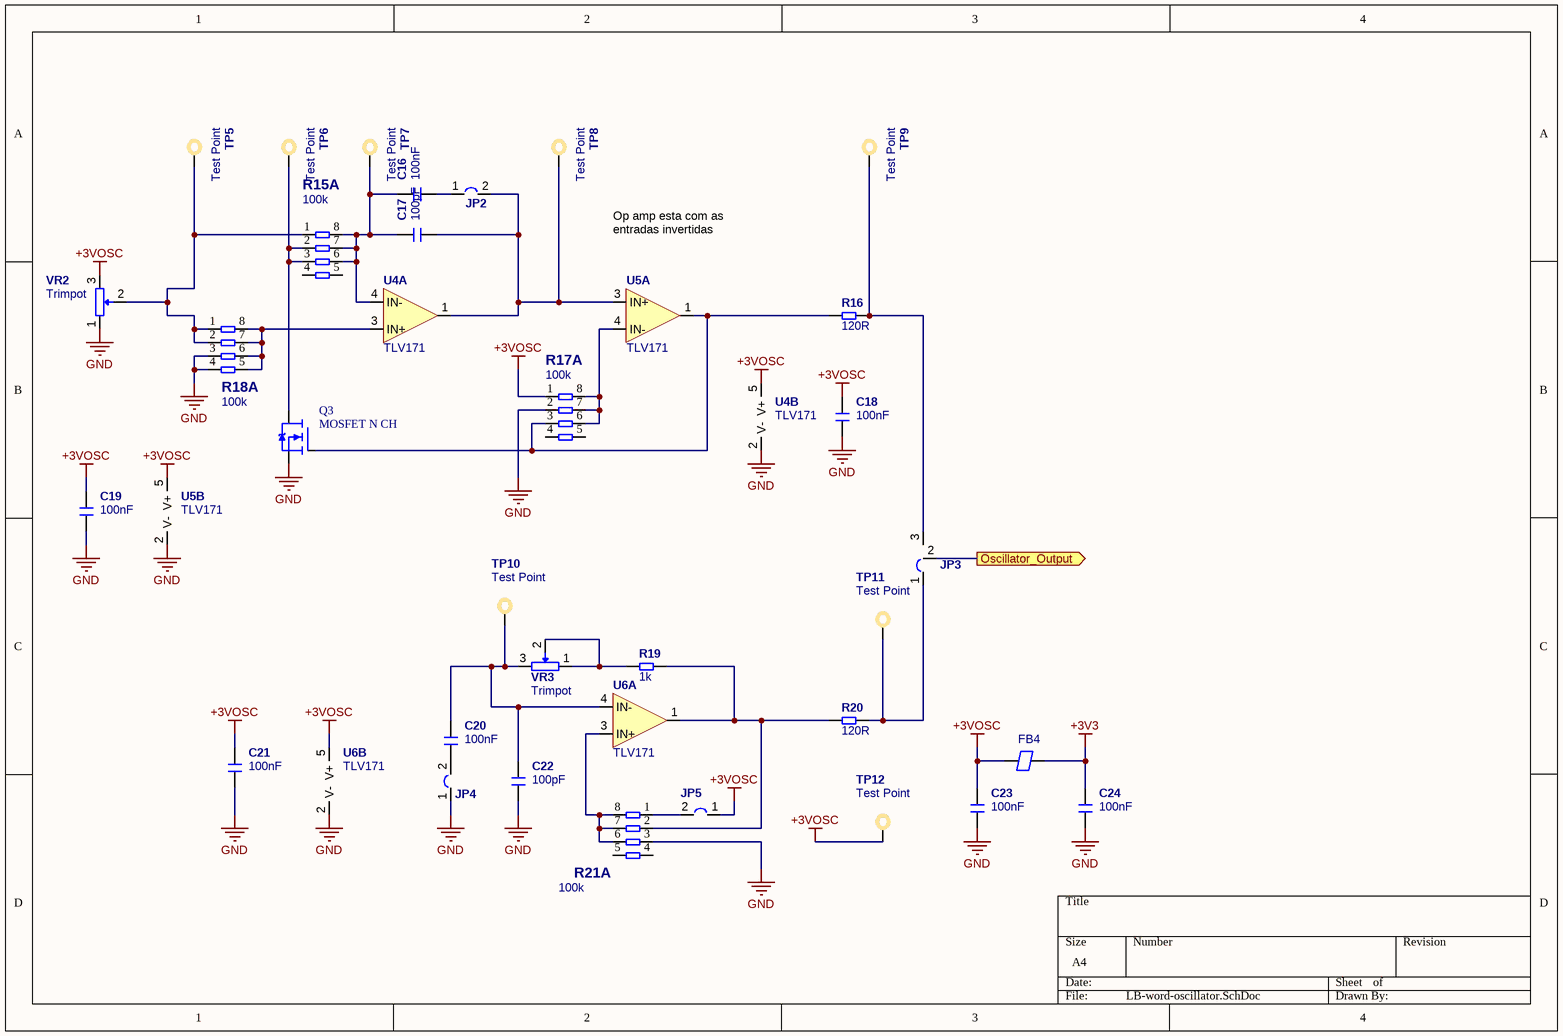
[diagram p8: LB-word-oscillator.SchDoc]

### Parts
C16  100nF  [C0603_N]
C17  100pF  [C0603_N]
C18  100nF  [C0603_N]
C19  100nF  [C0603_N]
C20  100nF  [C0603_N]
C21  100nF  [C0603_N]
C22  100pF  [C0603_N]
C23  100nF  [C0603_N]
C24  100nF  [C0603_N]
FB4  Ferrite Bead  [F0603_N]  (value not drawn)
JP2  Jumper 2W  [Jumper SMD 2W NO]  (value not drawn)
JP3  Jumper 3W  [Jumper SMD 3W NO]  (value not drawn)
JP4  Jumper 2W  [Jumper SMD 2W NO]  (value not drawn)
JP5  Jumper 2W  [Jumper SMD 2W NO]  (value not drawn)
Q3  MOSFET N CH  [SOT23_N]
R15  value 100k  [YC164]  (parts A,B,C,D of 4)
R16  120R  [R0603]
R17  value 100k  [YC164]  (parts A,B,C,D of 4)
R18  value 100k  [YC164]  (parts A,B,C,D of 4)
R19  1k  [R0603]
R20  120R  [R0603]
R21  value 100k  [YC164]  (parts A,B,C,D of 4)
TP5  Test Point  [TestPoint-1.2mm]
TP6  Test Point  [TestPoint-1.2mm]
TP7  Test Point  [TestPoint-1.2mm]
TP8  Test Point  [TestPoint-1.2mm]
TP9  Test Point  [TestPoint-1.2mm]
TP10  Test Point  [TestPoint-1.2mm]
TP11  Test Point  [TestPoint-1.2mm]
TP12  Test Point  [TestPoint-1.2mm]
U4  TLV171  [SOT23-5_N]  (parts A,B of 2)
U5  TLV171  [SOT23-5_N]  (parts A,B of 2)
U6  TLV171  [SOT23-5_N]  (parts A,B of 2)
VR2  Trimpot  [Trimpot 3314]
VR3  Trimpot  [Trimpot 3314]

### Ports
Oscillator_Output (out)

### Nets
+3V3: C24.1 FB4.2
+3VOSC: C18.1 C19.1 C21.1 C23.1 FB4.1 JP5.1 R17.1 TP12.1 U4.5(V+) U5.5(V+) U6.5(V+) VR2.3
GND: C18.2 C19.2 C21.2 C22.2 C23.2 C24.2 JP4.1 Q3.3(S) R17.3 R17.4 R18.2 R21.3 U4.2(V-) U5.2(V-) U6.2(V-) VR2.1
Coil_Square_Wave: JP3.2 ; port Oscillator_Output
NetC16_1: C16.1 C17.1 R15.6 R15.7 R15.8 TP7.1 U4.4(IN-)
NetC16_2: C16.2 JP2.1
NetC17_2: C17.2 JP2.2 TP8.1 U4.1(OUT) U5.3(IN+)
NetC20_1: C20.1 C22.1 TP10.1 U6.4(IN-) VR3.3
NetC20_2: C20.2 JP4.2
NetJP3_1: JP3.1 R20.2 TP11.1
NetJP3_3: JP3.3 R16.2 TP9.1
NetJP5_2: JP5.2 R21.1
NetQ3_1: Q3.1(G) R16.1 R18.3 U5.1(OUT)
NetQ3_2: Q3.2(D) R15.2 R15.3 TP6.1
NetR15_1: R15.1 R17.2 R18.1 TP5.1 VR2.2
NetR17_5: R17.5 R17.6 R17.7 R18.8 U4.3(IN+)
NetR17_8: R17.8 R18.6 R18.7 U5.4(IN-)
NetR19_1: R19.1 VR3.1 VR3.2
NetR19_2: R19.2 R20.1 R21.2 U6.1(OUT)
NetR21_6: R21.6 R21.7 R21.8 U6.3(IN+)

Not connected (* = marked no-connect by the designer): R15 4 5; R18 4 5; R21 4 5

### Notes on the sheet
- (near U5) Op amp esta com as entradas invertidas

### Library data of the parts
C16-C24 = Capacitor: as C9 on sheet LB-word-topLevel; Category: Capacitor; Package: 0603; Supplier Part Number 1: 1362556; Supplier 1: Farnell; ComponentLink1URL: http://www.yageo.com; ComponentLink1Description: Manufacturer Website; Voltage Rating (Volts): *; Supplier 2: Digi-Key; Supplier Part Number 2: 311-1344-1-ND
  C16 C18-C21 C23 C24: Value: 100nF
  C17 C22: Value: 100pF
R15 R17 R18 R21 = Resistor Array - 4P
R16 R19 R20 = Resistor: Published: 17-Dec-2003; LatestRevisionDate: 19-Mar-2004; LatestRevisionNote: Silkscreen size reduced.; PackageDocument: Mar-2003; PackageReference: 3-0603; Publisher: Altium Limited; Code_IPC: 1608 [0603]; ComponentLink1Description: Manufacturer Link; ComponentLink1URL: http://www.panasonic.com/industrial/components/resistive_products.htm; ComponentLink2Description: Datasheet; ComponentLink2URL: http://www.panasonic.com/industrial/components/pdf/AOA0000CE2.pdf
  R16 R20: Value: 120R
  R19: Value: 1k
U4-U6 = TLV171: Single RRO Opamp

## Sheet LB-word-MCU.SchDoc
size A
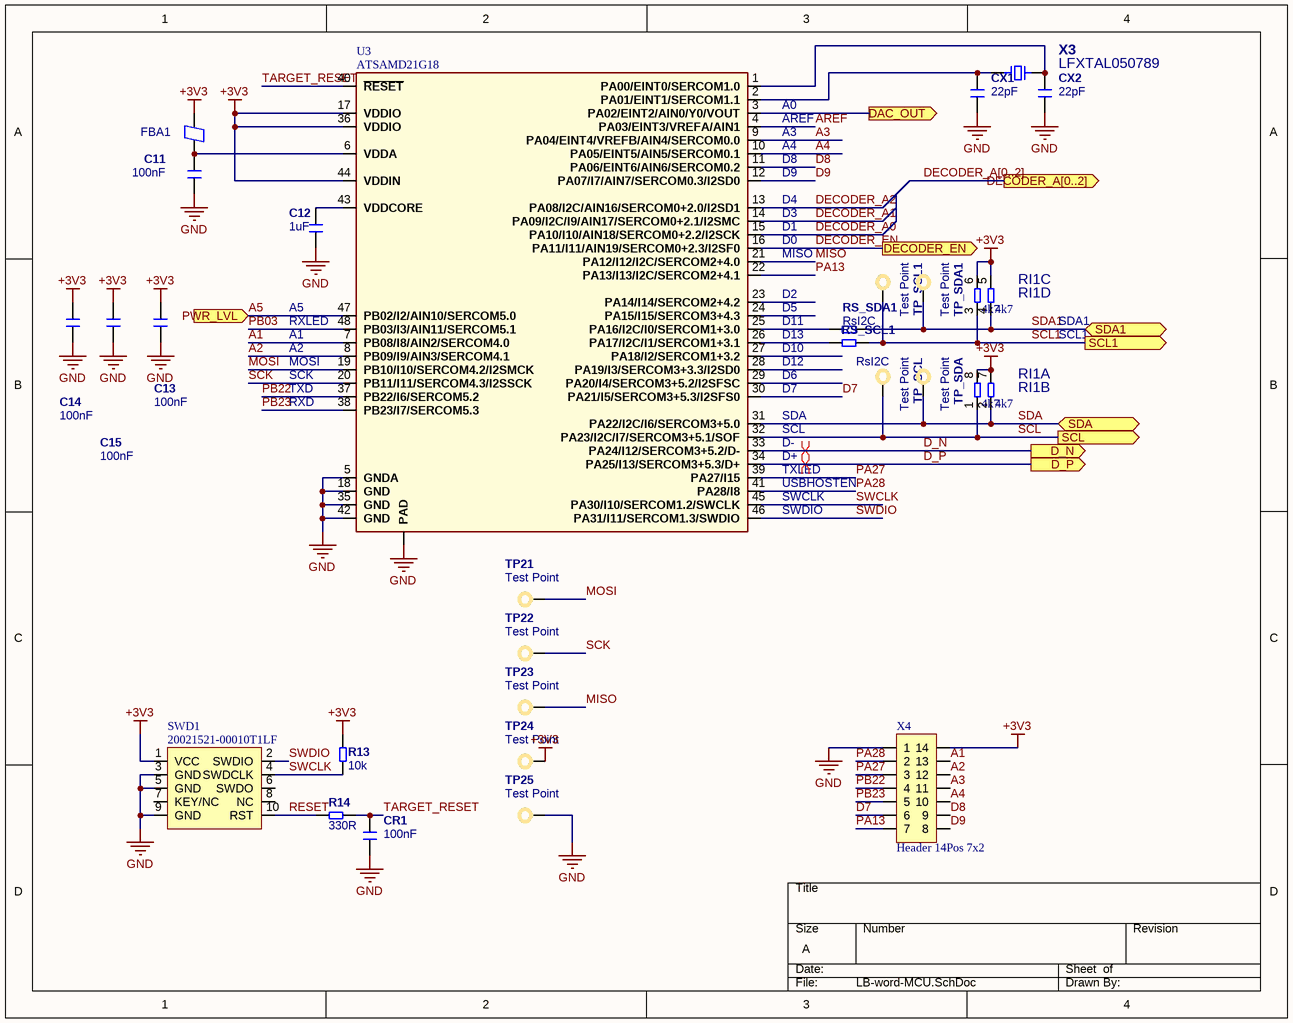
[diagram p9: LB-word-MCU.SchDoc]

### Parts
C11  100nF  [C0603_N]
C12  1uF  [C0603_N]
C13  100nF  [C0603_N]
C14  100nF  [C0603_N]
C15  100nF  [C0603_N]
CR1  100nF  [C0603_N]
CX1  22pF  [C0603_N]
CX2  22pF  [C0603_N]
FBA1  FB  [F0603_N]  (value not drawn)
R13  10k  [R0603]
R14  330R  [R0603]
RI1  value 4k7  [YC164]  (parts A,B,C,D of 4)
RS_SCL1  RsI2C  [R0603]
RS_SDA1  RsI2C  [R0603]
SWD1  20021521-00010T1LF  [Header 10P 50mil]
TP21  Test Point  [TestPoint-1.2mm]
TP22  Test Point  [TestPoint-1.2mm]
TP23  Test Point  [TestPoint-1.2mm]
TP24  Test Point  [TestPoint-1.2mm]
TP25  Test Point  [TestPoint-1.2mm]
TP_SCL  Test Point  [TestPoint-1.2mm]
TP_SCL1  Test Point  [TestPoint-1.2mm]
TP_SDA  Test Point  [TestPoint-1.2mm]
TP_SDA1  Test Point  [TestPoint-1.2mm]
U3  ATSAMD21G18  [QFN48_M]
X3  LFXTAL050789  [Crystal 0805]
X4  Header 14Pos 7x2  [Header 7x2 SMD 2.54mm]

### Ports
D_N (out), D_P (out), DAC_OUT (out), DECODER_A[0..2] (out), DECODER_EN (out), PWR_LVL (in), SCL1 (out), SCL (out), SDA1 (bidir), SDA (bidir)

### Nets
+3V3: C13.1 C14.1 C15.1 FBA1.2 R13.2 RI1.5 RI1.6 RI1.7 RI1.8 SWD1.1(VCC) TP24.1 U3.17(VDDIO) U3.36(VDDIO) U3.44(VDDIN) X4.14
GND: C11.2 C12.2 C13.2 C14.2 C15.2 CR1.2 CX1.2 CX2.2 SWD1.3(GND) SWD1.5(GND) SWD1.9(GND) TP25.1 U3.5(GNDA) U3.18(GND) U3.35(GND) U3.42(GND) U3.49(PAD) X4.1
A1: U3.7(PB08/I8/AIN2/SERCOM4.0) X4.13
A2: U3.8(PB09/I9/AIN3/SERCOM4.1) X4.12
A3: U3.9(PA04/EINT4/VREFB/AIN4/SERCOM0.0) X4.11
A4: U3.10(PA05/EINT5/AIN5/SERCOM0.1) X4.10
A5: U3.47(PB02/I2/AIN10/SERCOM5.0) ; port PWR_LVL
AREF: U3.4(PA03/EINT3/VREFA/AIN1)
D7: U3.30(PA21/I5/SERCOM3+5.3/I2SFS0) X4.6
D8: U3.11(PA06/EINT6/AIN6/SERCOM0.2) X4.9
D9: U3.12(PA07/I7/AIN7/SERCOM0.3/I2SD0) X4.8
D_N: U3.33(PA24/I12/SERCOM3+5.2/D-) ; port D_N
D_P: U3.34(PA25/I13/SERCOM3+5.3/D+) ; port D_P
DECODER_A0: U3.15(PA10/I10/AIN18/SERCOM0+2.2/I2SCK)
DECODER_A1: U3.14(PA09/I2C/I9/AIN17/SERCOM0+2.1/I2SMC)
DECODER_A2: U3.13(PA08/I2C/AIN16/SERCOM0+2.0/I2SD1)
DECODER_EN: U3.16(PA11/I11/AIN19/SERCOM0+2.3/I2SF0) ; port DECODER_EN
MCU_DAC: U3.3(PA02/EINT2/AIN0/Y0/VOUT) ; port DAC_OUT
MISO: TP23.1 U3.21(PA12/I12/I2C/SERCOM2+4.0)
MOSI: TP21.1 U3.19(PB10/I10/SERCOM4.2/I2SMCK)
PA13: U3.22(PA13/I13/I2C/SERCOM2+4.1) X4.7
PA27: U3.39(PA27/I15) X4.3
PA28: U3.41(PA28/I8) X4.2
PB03: U3.48(PB03/I3/AIN11/SERCOM5.1)
PB22: U3.37(PB22/I6/SERCOM5.2) X4.4
PB23: U3.38(PB23/I7/SERCOM5.3) X4.5
RESET: R14.1 SWD1.10(RST)
SCK: TP22.1 U3.20(PB11/I11/SERCOM4.3/I2SSCK)
SCL: RI1.1 TP_SCL.1 U3.32(PA23/I2C/I7/SERCOM3+5.1/SOF) ; port SCL
SCL1: RI1.3 RS_SCL1.2 TP_SCL1.1 ; port SCL1
SDA: RI1.2 TP_SDA.1 U3.31(PA22/I2C/I6/SERCOM3+5.0) ; port SDA
SDA1: RI1.4 RS_SDA1.2 TP_SDA1.1 ; port SDA1
SWCLK: R13.1 SWD1.4(SWDCLK) U3.45(PA30/I10/SERCOM1.2/SWCLK)
SWDIO: SWD1.2(SWDIO) U3.46(PA31/I11/SERCOM1.3/SWDIO)
TARGET_RESET: CR1.1 R14.2 U3.40(~{RESET})
NetC11_1: C11.1 FBA1.1 U3.6(VDDA)
NetC12_1: C12.1 U3.43(VDDCORE)
NetCX1_1: CX1.1 U3.2(PA01/EINT1/SERCOM1.1) X3.1
NetCX2_1: CX2.1 U3.1(PA00/EINT0/SERCOM1.0) X3.2
NetRS_SCL1_1: RS_SCL1.1 U3.26(PA17/I2C/I1/SERCOM1+3.1)
NetRS_SDA1_1: RS_SDA1.1 U3.25(PA16/I2C/I0/SERCOM1+3.0)

Not connected (* = marked no-connect by the designer): SWD1 6(SWDO) 7(KEY/NC) 8(NC); U3 23(PA14/I14/SERCOM2+4.2) 24(PA15/I15/SERCOM3+4.3) 27(PA18/I2/SERCOM1+3.2) 28(PA19/I3/SERCOM3+3.3/I2SD0) 29(PA20/I4/SERCOM3+5.2/I2SFSC)

### Buses and harness runs
bus DECODER_A[0..2] = port DECODER_A[0..2]

### Layout directives
differential pair: D_N, D_P

### Notes on the sheet
- SDA1
- SCL1
- (in symbol ATSAMD21G18) A0; AREF; A3; A4; D8; D9; D4; D3; D1; D0; MISO; D2; A5; D5; RXLED; D11; A1; D13; A2; D10; MOSI; D12; SCK; D6; TXD; D7; RXD; SDA; SCL; D-; D+; TXLED; USBHOSTEN; SWCLK; SWDIO

### Library data of the parts
C11-C15 CR1 CX1 CX2 = Capacitor: as C9 on sheet LB-word-topLevel; Category: Capacitor; Package: 0603; Supplier Part Number 1: 1362556; Supplier 1: Farnell; ComponentLink1URL: http://www.yageo.com; ComponentLink1Description: Manufacturer Website; Voltage Rating (Volts): *; Supplier 2: Digi-Key; Supplier Part Number 2: 311-1344-1-ND
  C11 C13-C15 CR1: Value: 100nF
  C12: Value: 1uF
  CX1 CX2: Value: 22pF
FBA1 = Ferrite Bead
R13 R14 RS_SCL1 RS_SDA1 = Resistor: Published: 17-Dec-2003; LatestRevisionDate: 19-Mar-2004; LatestRevisionNote: Silkscreen size reduced.; PackageDocument: Mar-2003; PackageReference: 3-0603; Publisher: Altium Limited; Code_IPC: 1608 [0603]; ComponentLink1Description: Manufacturer Link; ComponentLink1URL: http://www.panasonic.com/industrial/components/resistive_products.htm; ComponentLink2Description: Datasheet; ComponentLink2URL: http://www.panasonic.com/industrial/components/pdf/AOA0000CE2.pdf
  R13: Value: 10k
  R14: Value: 330R
  RS_SCL1 RS_SDA1: Value: RsI2C
RI1 = Resistor Array - 4P
SWD1 = SWD
X3 = Crystal: Value: LFXTAL050789

## Sheet LB-word-diffI2C.SchDoc
size A4
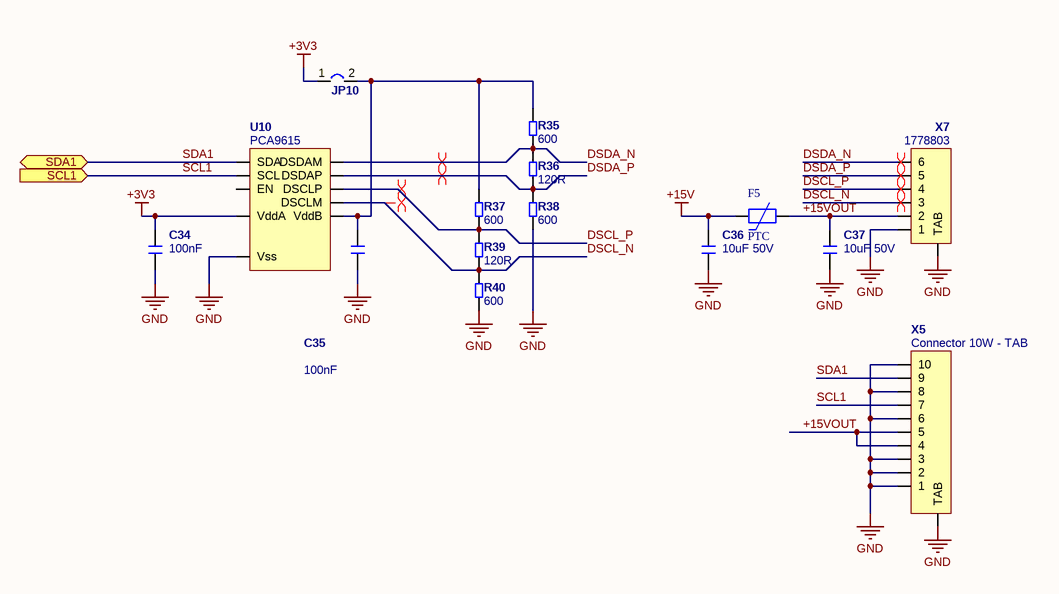
[diagram p10: LB-word-diffI2C.SchDoc]

### Parts
C34  100nF  [C0603_N]
C35  100nF  [C0603_N]
C36  10uF 50V  [C1210_N]
C37  10uF 50V  [C1210_N]
F5  PTC  [1812]
JP10  Jumper 2W  [Jumper SMD 2W NO]  (value not drawn)
R35  600  [R0603]
R36  120R  [R0603]
R37  600  [R0603]
R38  600  [R0603]
R39  120R  [R0603]
R40  600  [R0603]
U10  PCA9615  [TSSOP10]
X5  Connector 10W - TAB  [FPC Conn. 10W 1-84953-0]
X7  1778803  [PTSM-6W-H-SMD]

### Ports
SCL1 (in), SDA1 (bidir)

### Nets
+3V3: C34.1 JP10.1 U10.1(VddA)
+15V: C36.1 F5.1
GND: C34.2 C35.2 C36.2 C37.2 R38.1 R40.1 U10.5(Vss) X5.1 X5.2 X5.3 X5.6 X5.8 X5.10 X5.TAB X7.1 X7.TAB
+15VOUT: C37.1 F5.2 X5.4 X5.5 X7.2
DSCL_N: R39.1 R40.2 U10.6(DSCLM) X7.3
DSCL_P: R37.1 R39.2 U10.7(DSCLP) X7.4
DSDA_N: R35.1 R36.2 U10.9(DSDAM) X7.6
DSDA_P: R36.1 R38.2 U10.8(DSDAP) X7.5
SCL1: U10.4(SCL) X5.7 ; port SCL1
SDA1: U10.2(SDA) X5.9 ; port SDA1
NetC35_1: C35.1 JP10.2 R35.2 R37.2 U10.10(VddB)

Not connected (* = marked no-connect by the designer): U10 3(EN)

### Layout directives
differential pair: DSCL_N, DSCL_P, DSDA_N, DSDA_P

### Library data of the parts
C34-C37 = Capacitor: as C9 on sheet LB-word-topLevel; Category: Capacitor; Package: 0603; Supplier Part Number 1: 1362556; Supplier 1: Farnell; ComponentLink1URL: http://www.yageo.com; ComponentLink1Description: Manufacturer Website; Voltage Rating (Volts): *; Supplier 2: Digi-Key; Supplier Part Number 2: 311-1344-1-ND
  C34 C35: Value: 100nF
  C36 C37: Value: 10uF 50V
F5 = PTC: PTC, Resettable Fuse
R35-R40 = Resistor: Published: 17-Dec-2003; LatestRevisionDate: 19-Mar-2004; LatestRevisionNote: Silkscreen size reduced.; PackageDocument: Mar-2003; PackageReference: 3-0603; Publisher: Altium Limited; Code_IPC: 1608 [0603]; ComponentLink1Description: Manufacturer Link; ComponentLink1URL: http://www.panasonic.com/industrial/components/resistive_products.htm; ComponentLink2Description: Datasheet; ComponentLink2URL: http://www.panasonic.com/industrial/components/pdf/AOA0000CE2.pdf
  R35 R37 R38 R40: Value: 600
  R36 R39: Value: 120R
U10 = PCA9615DP
X7 = Connector 6W - TAB

## Nets that join several sheets
+3V3: LB-word-topLevel (R10.1), Char1 (C7_Char1.1 FB3_Char1.1), Char2 (C7_Char2.1 FB3_Char2.1), Char3 (C7_Char3.1 FB3_Char3.1), Char4 (C7_Char4.1 FB3_Char4.1), Char5 (C7_Char5.1 FB3_Char5.1), Char6 (C7_Char6.1 FB3_Char6.1), Char7 (C7_Char7.1 FB3_Char7.1), Char8 (C7_Char8.1 FB3_Char8.1), LB-word-decoder (10 pins), LB-word-charsBuffer (C10.1 U2.20), LB-word-PSU-3V (JP7.2), LB-word-gpioExpanders (7 pins), LB-word-oscillator (C24.1 FB4.2), LB-word-MCU (15 pins), LB-word-diffI2C (C34.1 JP10.1 U10.1)
+15V: Char1 (C4_Char1.1 FB1_Char1.1 TP1_Char1.1), Char2 (C4_Char2.1 FB1_Char2.1 TP1_Char2.1), Char3 (C4_Char3.1 FB1_Char3.1 TP1_Char3.1), Char4 (C4_Char4.1 FB1_Char4.1 TP1_Char4.1), Char5 (C4_Char5.1 FB1_Char5.1 TP1_Char5.1), Char6 (C4_Char6.1 FB1_Char6.1 TP1_Char6.1), Char7 (C4_Char7.1 FB1_Char7.1 TP1_Char7.1), Char8 (C4_Char8.1 FB1_Char8.1 TP1_Char8.1), LB-word-PSU-24V (JP9.2), LB-word-diffI2C (C36.1 F5.1)
GND: LB-word-topLevel (5 pins), Char1 (26 pins), Char2 (26 pins), Char3 (26 pins), Char4 (26 pins), Char5 (26 pins), Char6 (26 pins), Char7 (26 pins), Char8 (26 pins), LB-word-decoder (9 pins), LB-word-charsBuffer (12 pins), LB-word-PSU-3V (7 pins), LB-word-powerOR (11 pins), LB-word-PSU-24V (17 pins), LB-word-gpioExpanders (25 pins), LB-word-oscillator (16 pins), LB-word-MCU (18 pins), LB-word-diffI2C (16 pins)
V_Raw: LB-word-topLevel (D7.K X2.2), LB-word-powerOR (F3.1 TVS1.1 X6.2)
VIN: LB-word-PSU-3V (JP6.1 SHUNT1.1 TP13.1), LB-word-powerOR (6 pins), LB-word-PSU-24V (JP8.1 SHUNT2.1 TP_VIN1.1)
~{ENABLE}: Char1 (JP11_Char1.1 X1_Char1.20), LB-word-decoder (R2.8)
~{ENABLE}: Char2 (JP11_Char2.1 X1_Char2.20), LB-word-decoder (R2.7)
~{ENABLE}: Char3 (JP11_Char3.1 X1_Char3.20), LB-word-decoder (R2.6)
~{ENABLE}: Char4 (JP11_Char4.1 X1_Char4.20), LB-word-decoder (R2.5)
~{ENABLE}: Char5 (JP11_Char5.1 X1_Char5.20), LB-word-decoder (R3.8)
~{ENABLE}: Char6 (JP11_Char6.1 X1_Char6.20), LB-word-decoder (R3.7)
~{ENABLE}: Char7 (JP11_Char7.1 X1_Char7.20), LB-word-decoder (R3.6)
~{ENABLE}: Char8 (JP11_Char8.1 X1_Char8.20), LB-word-decoder (R3.5)
A5: LB-word-powerOR (R25.6), LB-word-MCU (U3.47)
BIT0: Char1 (X1_Char1.16), Char2 (X1_Char2.16), Char3 (X1_Char3.16), Char4 (X1_Char4.16), Char5 (X1_Char5.16), Char6 (X1_Char6.16), Char7 (X1_Char7.16), Char8 (X1_Char8.16), LB-word-charsBuffer (U2.9)
BIT1: Char1 (X1_Char1.14), Char2 (X1_Char2.14), Char3 (X1_Char3.14), Char4 (X1_Char4.14), Char5 (X1_Char5.14), Char6 (X1_Char6.14), Char7 (X1_Char7.14), Char8 (X1_Char8.14), LB-word-charsBuffer (U2.8)
BIT2: Char1 (X1_Char1.12), Char2 (X1_Char2.12), Char3 (X1_Char3.12), Char4 (X1_Char4.12), Char5 (X1_Char5.12), Char6 (X1_Char6.12), Char7 (X1_Char7.12), Char8 (X1_Char8.12), LB-word-charsBuffer (U2.7)
BIT3: Char1 (X1_Char1.10), Char2 (X1_Char2.10), Char3 (X1_Char3.10), Char4 (X1_Char4.10), Char5 (X1_Char5.10), Char6 (X1_Char6.10), Char7 (X1_Char7.10), Char8 (X1_Char8.10), LB-word-charsBuffer (U2.6)
BIT4: Char1 (X1_Char1.8), Char2 (X1_Char2.8), Char3 (X1_Char3.8), Char4 (X1_Char4.8), Char5 (X1_Char5.8), Char6 (X1_Char6.8), Char7 (X1_Char7.8), Char8 (X1_Char8.8), LB-word-charsBuffer (U2.5)
BIT5: Char1 (X1_Char1.6), Char2 (X1_Char2.6), Char3 (X1_Char3.6), Char4 (X1_Char4.6), Char5 (X1_Char5.6), Char6 (X1_Char6.6), Char7 (X1_Char7.6), Char8 (X1_Char8.6), LB-word-charsBuffer (U2.4)
BIT6: Char1 (X1_Char1.4), Char2 (X1_Char2.4), Char3 (X1_Char3.4), Char4 (X1_Char4.4), Char5 (X1_Char5.4), Char6 (X1_Char6.4), Char7 (X1_Char7.4), Char8 (X1_Char8.4), LB-word-charsBuffer (U2.3)
BIT7: Char1 (X1_Char1.2), Char2 (X1_Char2.2), Char3 (X1_Char3.2), Char4 (X1_Char4.2), Char5 (X1_Char5.2), Char6 (X1_Char6.2), Char7 (X1_Char7.2), Char8 (X1_Char8.2), LB-word-charsBuffer (U2.2)
BIT_MCP0: LB-word-charsBuffer (R11.4 U2.11), LB-word-gpioExpanders (U7.16)
BIT_MCP1: LB-word-charsBuffer (R11.3 U2.12), LB-word-gpioExpanders (U7.15)
BIT_MCP2: LB-word-charsBuffer (R11.2 U2.13), LB-word-gpioExpanders (U7.14)
BIT_MCP3: LB-word-charsBuffer (R11.1 U2.14), LB-word-gpioExpanders (U7.13)
BIT_MCP4: LB-word-charsBuffer (R12.4 U2.15), LB-word-gpioExpanders (U7.12)
BIT_MCP5: LB-word-charsBuffer (R12.3 U2.16), LB-word-gpioExpanders (U7.11)
BIT_MCP6: LB-word-charsBuffer (R12.2 U2.17), LB-word-gpioExpanders (U7.10)
BIT_MCP7: LB-word-charsBuffer (R12.1 U2.18), LB-word-gpioExpanders (U7.9)
Coil_Square_Wave: Char1 (U11_Char1.2), Char2 (U11_Char2.2), Char3 (U11_Char3.2), Char4 (U11_Char4.2), Char5 (U11_Char5.2), Char6 (U11_Char6.2), Char7 (U11_Char7.2), Char8 (U11_Char8.2), LB-word-oscillator (JP3.2)
Coil_Status1: Char1 (X1_Char1.24), LB-word-gpioExpanders (R41.8)
Coil_Status2: Char2 (X1_Char2.24), LB-word-gpioExpanders (R41.7)
Coil_Status3: Char3 (X1_Char3.24), LB-word-gpioExpanders (R41.6)
Coil_Status4: Char4 (X1_Char4.24), LB-word-gpioExpanders (R41.5)
Coil_Status5: Char5 (X1_Char5.24), LB-word-gpioExpanders (R26.8)
Coil_Status6: Char6 (X1_Char6.24), LB-word-gpioExpanders (R26.7)
Coil_Status7: Char7 (X1_Char7.24), LB-word-gpioExpanders (R26.6)
Coil_Status8: Char8 (X1_Char8.24), LB-word-gpioExpanders (R26.5)
Comp_VRef: LB-word-topLevel (C9.1 JP1.2), Char1 (FB2_Char1.1), Char2 (FB2_Char2.1), Char3 (FB2_Char3.1), Char4 (FB2_Char4.1), Char5 (FB2_Char5.1), Char6 (FB2_Char6.1), Char7 (FB2_Char7.1), Char8 (FB2_Char8.1)
D_N: LB-word-powerOR (TVS2.1 USB1.2), LB-word-MCU (U3.33)
D_P: LB-word-powerOR (TVS2.2 USB1.3), LB-word-MCU (U3.34)
DECODER_A0: LB-word-decoder (R1.1 R4.1), LB-word-MCU (U3.15)
DECODER_A1: LB-word-decoder (R1.2 R4.2), LB-word-MCU (U3.14)
DECODER_A2: LB-word-decoder (R1.3 R4.3), LB-word-MCU (U3.13)
DECODER_EN: LB-word-decoder (R1.4 R4.4), LB-word-MCU (U3.16)
MCU_DAC: LB-word-topLevel (R9.1), LB-word-MCU (U3.3)
SCL: LB-word-gpioExpanders (U7.19 U8.19), LB-word-MCU (RI1.1 TP_SCL.1 U3.32)
SCL1: LB-word-MCU (RI1.3 RS_SCL1.2 TP_SCL1.1), LB-word-diffI2C (U10.4 X5.7)
SDA: LB-word-gpioExpanders (U7.20 U8.20), LB-word-MCU (RI1.2 TP_SDA.1 U3.31)
SDA1: LB-word-MCU (RI1.4 RS_SDA1.2 TP_SDA1.1), LB-word-diffI2C (U10.2 X5.9)